# EAGLE design 1-WireSlavePlug (EAGLE 7.4.0)
ABBREV: hb1; PROJECT: Heading Board
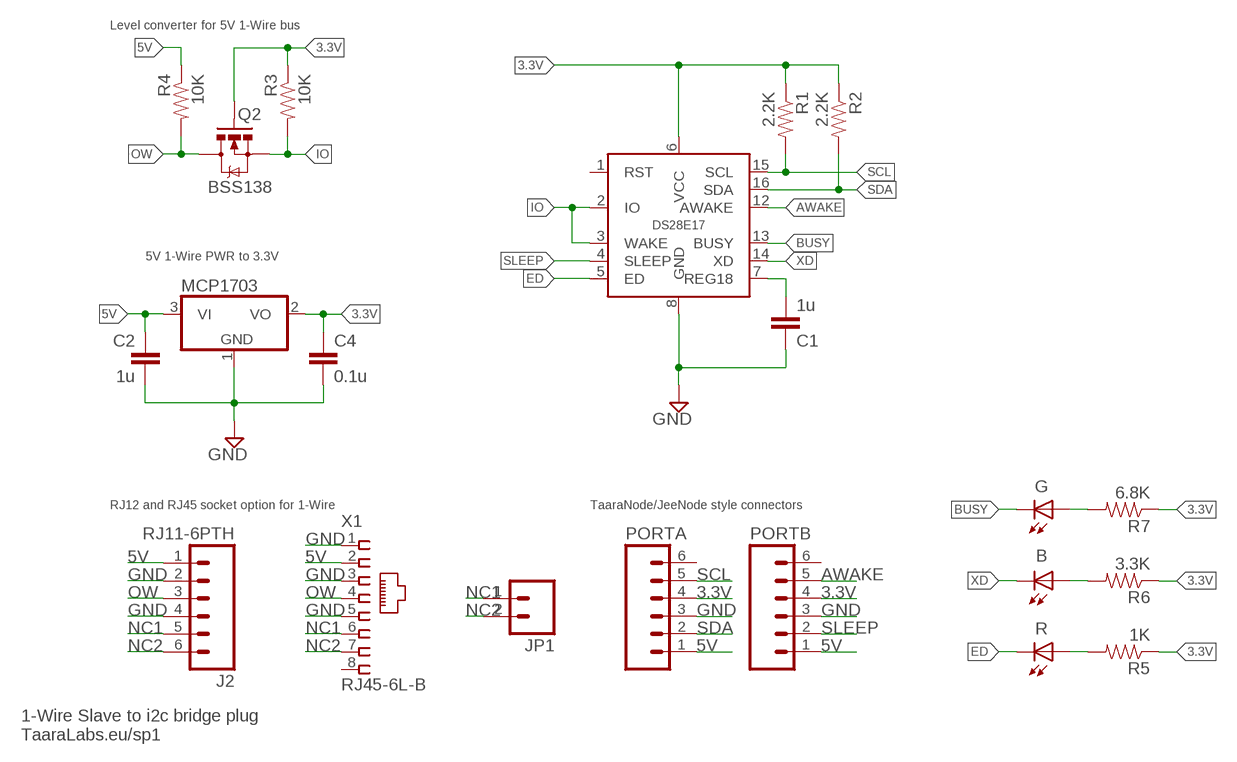
[diagram p0: schematic, sheet 1]

## Parts
C1  1u  CAP0603-CAP  [0603-CAP]
C2  1u  CAP0603-CAP  [0603-CAP]
C4  0.1u  CAP0603-CAP  [0603-CAP]
IC3  MCP1703  MCP1703CB  [SOT23]
J2  RJ11-6PTH  [RJ11-6]
JP1  M02PTH  [1X02]
LED  R  LEDCHIPLED_0603  [CHIPLED_0603]
LED1  B  LEDCHIPLED_0603  [CHIPLED_0603]
LED2  G  LEDCHIPLED_0603  [CHIPLED_0603]
PORTA  M06SIP_LOCK  [1X06-SIP_LOCK]
PORTB  M06SIP_LOCK  [1X06-SIP_LOCK]
Q2  BSS138  MOSFET-NCHANNELSMD  [SOT23-3]
R1  2.2K  RESISTOR0603-RES  [0603-RES]
R2  2.2K  RESISTOR0603-RES  [0603-RES]
R3  10K  RESISTOR0603-RES  [0603-RES]
R4  10K  RESISTOR0603-RES  [0603-RES]
R5  1K  RESISTOR0603-RES  [0603-RES]
R6  3.3K  RESISTOR0603-RES  [0603-RES]
R7  6.8K  RESISTOR0603-RES  [0603-RES]
U$2  DS28E17  [TQFN-16_4X4]
X1  RJ45-6L-B  [RJ45-NO-SHIELD]

## Nets
3.3V: C4.1 IC3.2(VO) PORTA.4 PORTB.4 Q2.1(G) R1.1 R2.1 R3.1 R5.1 R6.1 R7.1 U$2.6(VCC)
5V: C2.1 IC3.3(VI) J2.1 PORTA.1 PORTB.1 R4.1 X1.2
AWAKE: PORTB.5 U$2.12(AWAKE)
BUSY: LED2.C U$2.13(BUSY)
ED: LED.C U$2.5(ED)
GND: C1.1 C2.2 C4.2 IC3.1(GND) J2.2 J2.4 PORTA.3 PORTB.3 U$2.8(GND) X1.1 X1.3 X1.5
IO: Q2.2(S) R3.2 U$2.2(IO) U$2.3(WAKE)
N$1: C1.2 U$2.7(REG18)
N$2: LED.A R5.2
N$3: LED1.A R6.2
N$4: LED2.A R7.2
NC1: J2.5 JP1.1 X1.6
NC2: J2.6 JP1.2 X1.7
OW: J2.3 Q2.3(D) R4.2 X1.4
SCL: PORTA.5 R1.2 U$2.15(SCL)
SDA: PORTA.2 R2.2 U$2.16(SDA)
SLEEP: PORTB.2 U$2.4(SLEEP)
XD: LED1.C U$2.14(XD)
Unconnected: PORTA.6 PORTB.6 U$2.1(RST) X1.8

## Notes on the sheet
- Level converter for 5V 1-Wire bus
- 5V 1-Wire PWR to 3.3V
- RJ12 and RJ45 socket option for 1-Wire | TaaraNode/JeeNode style connectors
- 1-Wire Slave to i2c bridge plug
  TaaraLabs.eu/sp1

## Library data of the parts
C1 C2 C4 = SparkFun:CAP: Capacitor Standard 0603 ceramic capacitor, and 0.1" leaded capacitor.
IC3 = linear:MCP1703: 250 mA, 16V, Low Quiescent Current LDO Regulator Source: http://ww1.microchip.com/downloads/en/DeviceDoc/22049b.pdf
J2 = SparkFun:RJ11-6: RJ11 Jack Simple 6 pin RJ11 jack. Commonly found on CAT3 devices and Microchip programmers. SKU: PRT-00132
JP1 = SparkFun:M02: Header 2 Standard 2-pin 0.1" header. Use with straight break away headers (SKU : PRT-00116), right angle break away headers (PRT-00553), swiss pins (PRT-00743), machine pins (PRT-00117), and female headers (PRT-00115). Molex polarized connector foot print use with SKU : PRT-08233 with associated crimp pins and housings.
LED LED1 LED2 = adafruit:LED: LED OSRAM: - CHIPLED LG R971, LG N971, LY N971, LG Q971, LY Q971, LO R971, LY R971 LH N974, LH R974 LS Q976, LO Q976, LY Q976 LO Q996 - Hyper CHIPLED LW Q18S LB Q993, LB Q99A, LB R99A - SideLED LS A670, LO A670, LY A670, LG A670, LP A670 LB A673, LV A673, LT A673, LW A673 LH A674 LY A675 LS A676, LA A676, LO A676, LY A676, LW A676 LS A679, LY A679, LG A679 - Hyper Micro SIDELED® LS Y876, LA Y876, LO Y876, LY Y876 LT Y87S - SmartLED LW L88C, LW L88S LB L89C, LB L89S, LG L890 LS L89K, LO L89K, LY L89K LS L896, LA L896, LO L896, LY L896 - TOPLED LS T670, LO T670, LY T670, LG T670, LP T670 LSG T670, LSP T670, LSY T670, LOP T670, LYG T670 LG T671, LOG T671, LSG T671 LB T673, LV T673, LT T673, LW T673 LH T674 LS T676, LA T676, LO T676, LY T676, LB T676, LH T676, LSB T676, LW T676 LB T67C, LV T67C, LT T67C, LS T67K, LO T67K, LY T67K, LW E67C LS E67B, LA E67B, LO E67B, LY E67B, LB E67C, LV E67C, LT E67C LW T67C LS T679, LY T679, LG T679 LS T770, LO T770, LY T770, LG T770, LP T770 LB T773, LV T773, LT T773, LW T773 LH T774 LS E675, LA E675, LY E675, LS T675 LS T776, LA T776, LO T776, LY T776, LB T776 LHGB T686 LT T68C, LB T68C - Hyper Mini TOPLED® LB M676 - Mini TOPLED Santana® LG M470 LS M47K, LO M47K, LY M47K Source: http://www.osram.convergy.de/
PORTA PORTB = SparkFun-Connectors:M06: Header 6 Standard 6-pin 0.1" header. Use with straight break away headers (SKU : PRT-00116), right angle break away headers (PRT-00553), swiss pins (PRT-00743), machine pins (PRT-00117), and female headers (PRT-00115). Molex polarized connector foot print use with SKU : PRT-08094 with associated crimp pins and housings. NOTES ON THE VARIANTS LOCK and LOCK_LONGPADS... This footprint was designed to help hold the alignment of a through-hole component (i.e. 6-pin header) while soldering it into place. You may notice that each hole has been shifted either up or down by 0.005 of an inch from it's more standard position (which is a perfectly straight line). This slight alteration caused the pins (the squares in the middle) to touch the edges of the holes. Because they are alternating, it causes a "brace" to hold the component in place. 0.005 has proven to be the perfect amount of "off-center" position when using our standard breakaway headers. Although looks a little odd when you look at the bare footprint, once you have a header in there, the alteration is very hard to notice. Also,if you push a header all the way into place, it is covered up entirely on the bottom side. This idea of altering the position of holes to aid alignment will be further integrated into the Sparkfun Library for other footprints. It can help hold any component with 3 or more connection pins.
Q2 = SparkFun:MOSFET-NCHANNEL
R1-R7 = SparkFun:RESISTOR: Resistor Basic schematic elements and footprints for 0603, 1206, and PTH resistors.
U$2 = TaaraLabs:DS28E17: 1-Wire®-to-I2C Master Bridge Datasheet: https://datasheets.maximintegrated.com/en/ds/DS28E17.pdf
X1 = con-tycoelectronics:RJ45: CORCOM Modular RJ Jacks No Shield Source: www.tycoelectronics.com .. ENG_DS_1654001_1099_RJ_L_0507.pdf; MPN: RJ45-6L-B; OC_FARNELL: unknown; OC_NEWARK: 16R6090

## Net classes
0 default: width 0.203 mm
1 power: width 0.381 mm, clearance 0.254 mm

## Board
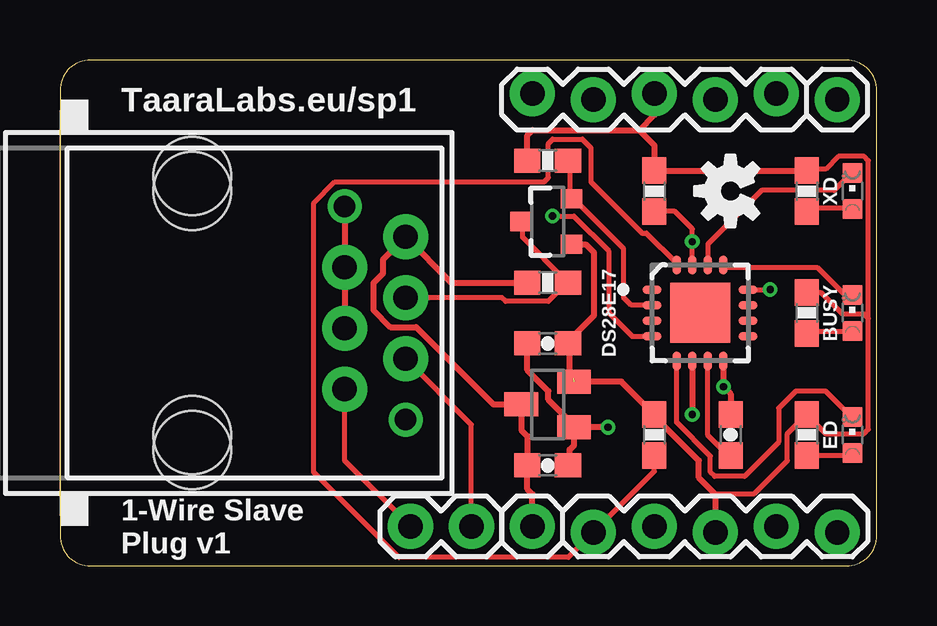
[diagram p1: board, top side]
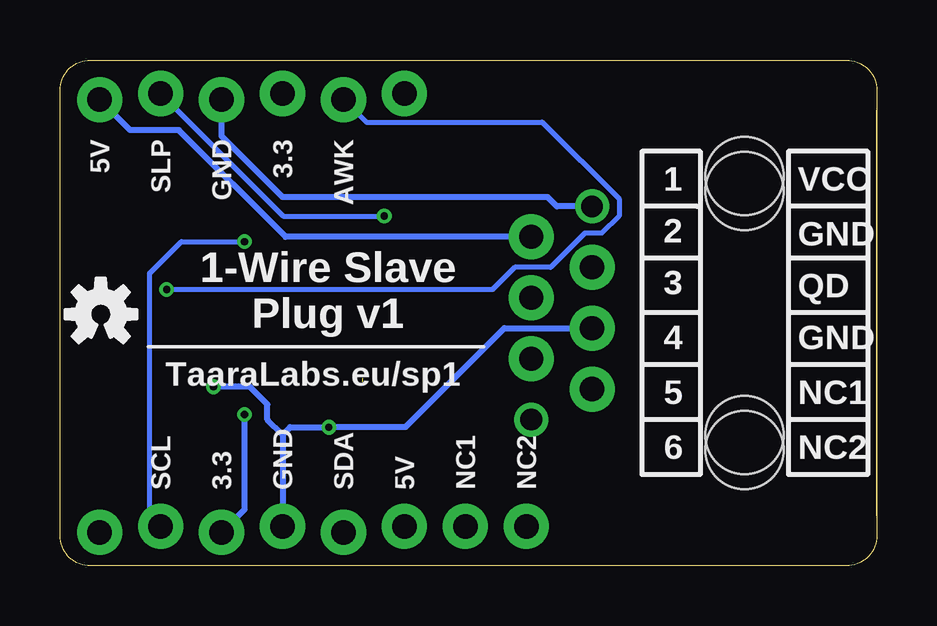
[diagram p2: board, bottom side, seen from below]

Size 34.04 x 21.08 mm. Coordinates in mm from the lower left corner, seen from the top.
Outline: 0,19.81 0,1.27 arc90 1.27,0 32.77,0 arc90 34.04,1.27 34.04,19.81 arc90 32.77,21.08 1.27,21.08 arc90 0,19.81
Copper layers (1*16): Top 0.035mm / dielectric 1.5mm / Bottom 0.035mm
Design rules "ITEADstudio_DRC": minimum track width 6mil, minimum drill 12mil, track to track 6mil, track to pad 6mil, pad to pad 6mil, via to via 6mil, smd to smd 0mil, copper to edge 10mil, drill to drill 10mil, minimum pad ring 10mil, minimum via ring 6mil, stop-mask expansion 2mil, vias tented up to drill 100mil, thermal gap 10mil

### Footprints (pad centres in the part's own frame; a part is rotated, then mirrored left to right if it is on the bottom)
0603-CAP = smd 1.1 x 1: 1 -0.85,0; 2 0.85,0
SOT23 = smd 1 x 1.4: 1 -0.95,-1.1; 2 0.95,-1.1; 3 0,1.1
RJ11-6 = drill 1.016 pad 1.88: 1 1.905,8.89; 2 3.175,6.35; 3 4.445,8.89; 4 5.715,6.35; 5 6.985,8.89; 6 8.255,6.35 | hole 3.251: 0,0; 10.16,0
1X02 = drill 1.016 pad 1.88: 1 0,0; 2 2.54,0
CHIPLED_0603 = smd 0.8 x 0.8: A 0,-0.75; C 0,0.75
1X06-SIP_LOCK = drill 1.016 pad 1.88: 1 0,0; 2 2.54,-0.254; 3 5.08,0; 4 7.62,-0.254; 5 10.16,0; 6 12.7,-0.254
SOT23-3 = smd 0.8 x 0.9: 1 -0.95,-1; 2 0.95,-1; 3 0,1.1
0603-RES = smd 1.1 x 1: 1 -0.85,0; 2 0.85,0
TQFN-16_4X4 = smd 0.8 x 0.35: 1 -2,0.975; 2 -2,0.325; 3 -2,-0.325; 4 -2,-0.975; 9 2,-0.975; 10 2,-0.325; 11 2,0.325; 12 2,0.975 | smd 0.35 x 0.8: 5 -0.975,-2; 6 -0.325,-2; 7 0.325,-2; 8 0.975,-2; 13 0.975,2; 14 0.325,2; 15 -0.325,2; 16 -0.975,2 | smd 2.5 x 2.5: PAD 0,0
RJ45-NO-SHIELD = drill 0.9 pad 1.4: 1 -4.445,6.35; 2 -3.175,8.89; 3 -1.905,6.35; 4 -0.635,8.89; 5 0.635,6.35; 6 1.905,8.89; 7 3.175,6.35; 8 4.445,8.89 | hole 3.251: -5.715,0; 5.715,0

### Placement (x,y rotation side)
C1  27.94,5.46 270 top
C2  20.32,4.19 0 top
C4  20.32,9.27 180 top
IC3  20.32,6.73 90 top
J2  5.51,15.62 270 top
JP1  17.15,1.65 180 top
LED  33.02,5.46 0 top
LED1  33.02,15.62 0 top
LED2  33.02,10.54 0 top
PORTA  19.69,1.65 0 top
PORTB  32.39,19.43 180 top
Q2  20.32,14.35 90 top
R1  24.77,15.62 270 top
R2  24.77,5.46 270 top
R3  20.32,16.89 0 top
R4  20.32,11.81 0 top
R5  31.12,5.46 270 top
R6  31.12,15.62 270 top
R7  31.12,10.54 270 top
U$1  [OSHW-LOGO-S]  27.94,15.62 90 top
U$2  26.67,10.54 0 top
U$3  [OSHW-LOGO-S]  32.33,10.49 0 bottom
X1  5.51,10.54 270 top

### Tracks (layer width: path | path; a pad name or v marks a point on that pad's centre or on a via)
3.3V  (via drill 0.3)  (1 unrouted)
  Top 0.203: 21.23,9.42 C4.1 21.23,9.25 | 21.59,7.65 IC3.2 | 33.68,10.31 33.5,10.49 32.61,10.49 31.73,11.38 31.19,11.38 R7.1 | 33.68,10.31 33.68,5.69 33.5,5.51 31.9,5.51 31.19,6.22 R5.1 31.01,6.22 30.3,5.51 30.3,4.39 28.91,3 27.3,3 | 33.68,10.31 33.68,16.89 33.5,17.07 32.44,17.07 31.9,16.54 31.19,16.54 R6.1
  Top 0.254: 21.23,9.42 22.25,10.44 22.25,13.06 21.91,13.4 Q2.1 | 21.23,9.25 21.23,8 21.41,7.82 | U$2.6 v26.34,6.31 | PORTA.4 27.3,3 26.62,3.68 26.62,4.39 24.79,6.22 R2.1 23.4,7.68 IC3.2 | R3.1 19.47,17.95 19.69,18.16 24.13,18.16 | 24.13,18.16 24.77,17.53 R1.1 R6.1 | 24.13,18.16 24.77,18.8 PORTB.4
  Bottom 0.254: v26.34,6.31 26.34,2.36 PORTA.4
5V
  Top 0.254: PORTA.1 19.69,2.99 19.47,3.21 C2.1 19.47,5.41 19.22,5.66 IC3.3 18.06,6.73 14.83,9.96 13.77,9.96 13.06,10.67 13.06,11.79 13.46,12.19 13.46,12.78 X1.2 16.31,11.81 R4.1
  Bottom 0.254: X1.2 24.64,13.72 29.08,18.16 31.12,18.16 PORTB.1
AWAKE  (via drill 0.3)
  Top 0.203: U$2.12 v29.59,11.52
  Bottom 0.203: PORTB.5 21.29,18.49 13.95,18.49 10.74,15.29 10.74,14.58 11.46,13.87 12.17,13.87 13.59,12.45 15.09,12.45 16.02,11.52 v29.59,11.52
BUSY
  Top 0.203: LED2.C 32.97,11.38 32.61,11.38 31.55,12.45 27.81,12.45 U$2.13
ED
  Top 0.203: 25.68,8.53 U$2.5 25.7,5.98 27.1,4.57 27.1,3.91 27.28,3.73 28.52,3.73 29.95,5.16 29.95,6.58 30.66,7.29 31.9,7.29 32.97,6.22 LED.C
GND  (via drill 0.3)
  Top 0.203: 21.23,4.27 C2.2 | 21.41,5.87 IC3.1
  Top 0.254: 21.41,5.87 20.34,6.93 20.34,7.29 19.47,8.17 C4.2 | U$2.8 v27.65,7.47 27.94,7.17 C1.1 | X1.1 J2.2 X1.5 | 21.23,4.27 21.23,4.85 21.42,5.04 IC3.1 v22.84,5.78
  Bottom 0.254: 24.77,5.46 PORTA.3 | X1.5 15.52,9.91 19.64,5.78 v22.84,5.78 24.45,5.78 24.77,5.46 | X1.1 13.34,14.99 13.72,15.37 24.77,15.37 27.3,17.91 PORTB.3 | 24.77,5.46 25.4,6.1 25.4,6.73 26.14,7.47 v27.65,7.47
IO
  Top 0.203: R3.2 21.23,16.89 21.23,15.47 Q2.2 21.41,15.29 23.47,13.23 23.47,11.2 23.8,10.87 U$2.2 U$2.3
N$1
  Top 0.203: C1.2 27.81,4.62 26.99,5.44 U$2.7
N$2
  Top 0.203: LED.A 32.97,4.62 31.19,4.62 R5.2
N$3
  Top 0.203: LED1.A 32.97,14.94 31.19,14.94 R6.2
N$4
  Top 0.203: LED2.A 32.97,9.78 31.19,9.78 R7.2
NC1
  Top 0.203: JP1.1 17.15,5.89 X1.6
NC2
  Top 0.203: JP1.2 11.86,4.39 J2.6
OW
  Top 0.203: Q2.3 19.28,14.22 19.28,13.69 21.06,11.91 R4.2 21.06,11.74 20.34,11.02 18.57,11.02 18.41,11.18 X1.4
SCL  (via drill 0.3)
  Top 0.203: 24.79,14.76 R1.2 25.62,14.77 26.34,14.04 v26.34,13.51 U$2.15
  Bottom 0.203: v26.34,13.51 28.98,13.51 30.3,12.19 30.3,2.11 PORTA.5
SDA
  Top 0.203: U$2.16 25.68,12.62 24.44,13.87 24.26,13.87 22.12,16 22.12,17.42 21.77,17.78 20.52,17.78 20.34,17.6 20.34,16.18 20.17,16 11.46,16 10.57,15.11 10.57,3.91 14.12,0.36 21.18,0.36 PORTA.2 24.77,3.94 R2.2
SLEEP  (via drill 0.3)
  Top 0.203: v20.52,14.58 21.41,14.58 22.86,13.13 22.86,10.54 23.84,9.57 U$2.4
  Bottom 0.203: v20.52,14.58 24.74,14.58 PORTB.2
XD
  Top 0.203: LED1.C 32.97,16.36 32.26,15.65 29.23,15.65 26.99,13.41 U$2.14

### Text on the board
tNames: TaaraLabs.eu/sp1 | XD | BUSY | ED | 1-Wire Slave / Plug v1
bNames: AWK | 3.3 | GND | SLP | 5V | VCC | 1 | GND | 2 | QD | 3 | 1-Wire Slave / Plug v1 | GND | 4 | NC1 | 5 | TaaraLabs.eu/sp1 | NC2 | 6 | NC2 | NC1 | 5V | SDA | GND | 3.3 | SCL